# EAGLE design ChargerLED_Base (EAGLE 6.1)
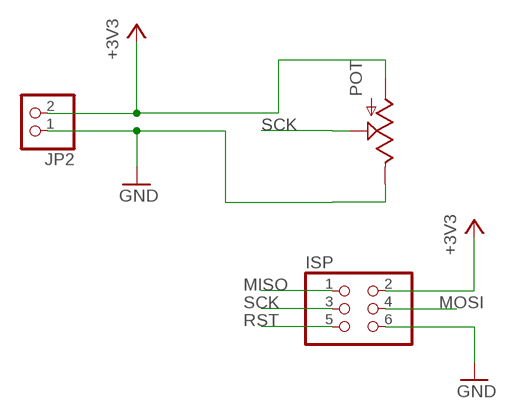
[diagram p0: schematic, sheet 1]

## Parts
ISP  PINHD-2X3  [2X03]
JP2  PINHD-1X2/90  [1X02/90]
POT  POT-RV16AF-20  [POT_ALPHA_RV16AF-20]

## Nets
+3V3: ISP.2 JP2.2 POT.1(A)
GND: ISP.6 JP2.1 POT.3(E)
MISO: ISP.1
MOSI: ISP.4
RST: ISP.5
SCK: ISP.3 POT.2(S)

## Library data of the parts
ISP = pinhead:PINHD-2X3: PIN HEADER
JP2 = pinhead:PINHD-1X2: PIN HEADER
POT = SparkFun-Electromechanical:POT

## Board
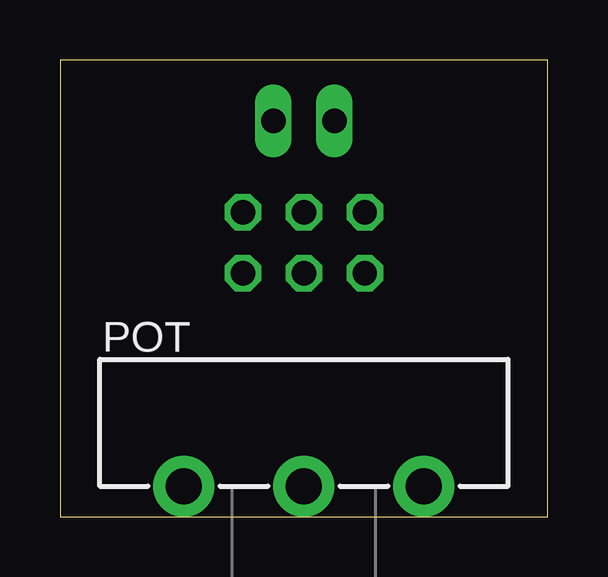
[diagram p1: board, top side]
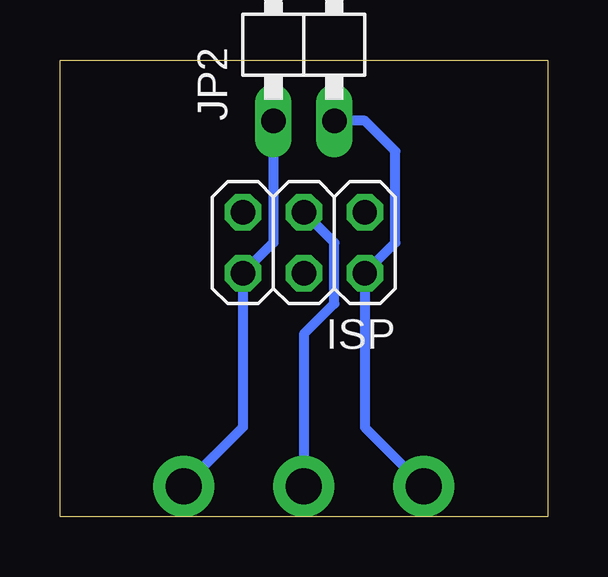
[diagram p2: board, bottom side, seen from below]

Size 20.32 x 19.05 mm. Coordinates in mm from the lower left corner, seen from the top.
Outline: 0,0 20.32,0 20.32,19.05 0,19.05 0,0
Copper layers (1*16): Top 0.035mm / dielectric 1.5mm / Bottom 0.035mm
Design rules: minimum track width 10mil, minimum drill 24mil, track to track 8mil, track to pad 8mil, pad to pad 8mil, via to via 8mil, smd to smd 8mil, copper to edge 30mil, drill to drill 8mil, minimum pad ring 10mil, minimum via ring 8mil, stop-mask expansion 4mil, vias tented up to drill 0mil, thermal gap 10mil

### Footprints (pad centres in the part's own frame; a part is rotated, then mirrored left to right if it is on the bottom)
2X03 = drill 1.016 octagon: 1 -2.54,-1.27; 2 -2.54,1.27; 3 0,-1.27; 4 0,1.27; 5 2.54,-1.27; 6 2.54,1.27
1X02/90 = drill 1.016 long: 1 -1.27,-3.81; 2 1.27,-3.81
POT_ALPHA_RV16AF-20 = drill 1.5 pad 2.54: 1 -5,0; 2 0,0; 3 5,0

### Placement (x,y rotation side)
ISP  10.16,11.43 180 bottom
JP2  10.16,20.32 0 bottom
POT  10.16,1.27 0 top

### Tracks (layer width: path | path; a pad name or v marks a point on that pad's centre or on a via)
+3V3
  Bottom 0.406: JP2.2 7.62,16.51 6.35,15.24 6.35,11.43 ISP.2 7.62,3.73 POT.1
GND
  Bottom 0.406: JP2.1 11.43,11.43 ISP.6 12.7,3.73 POT.3
SCK
  Bottom 0.406: ISP.3 8.89,11.43 8.89,8.89 10.16,7.62 POT.2